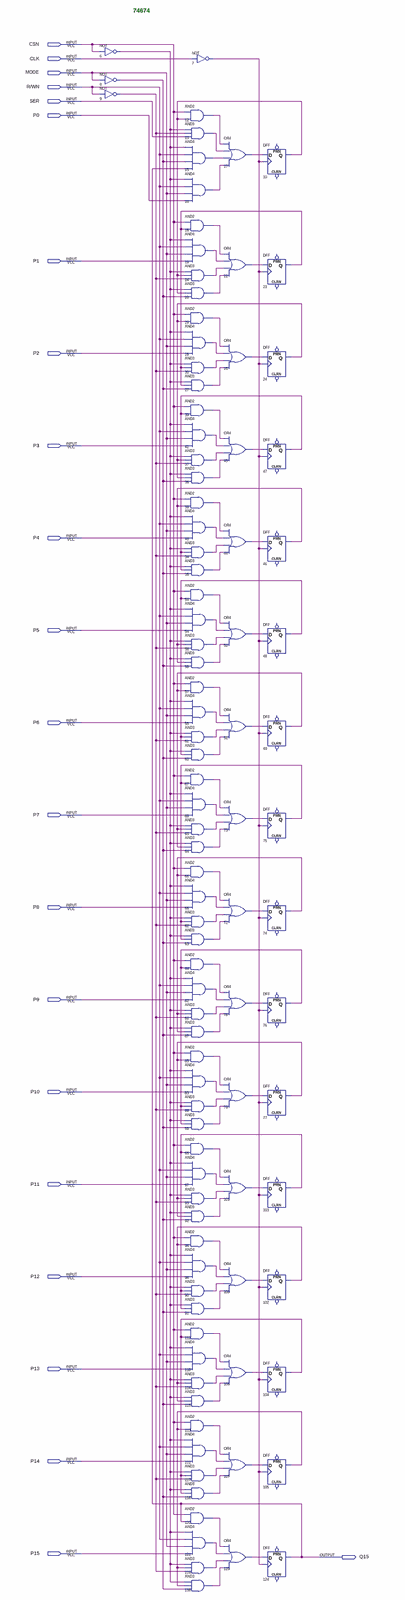
[diagram p0: schematic sheet, whole]
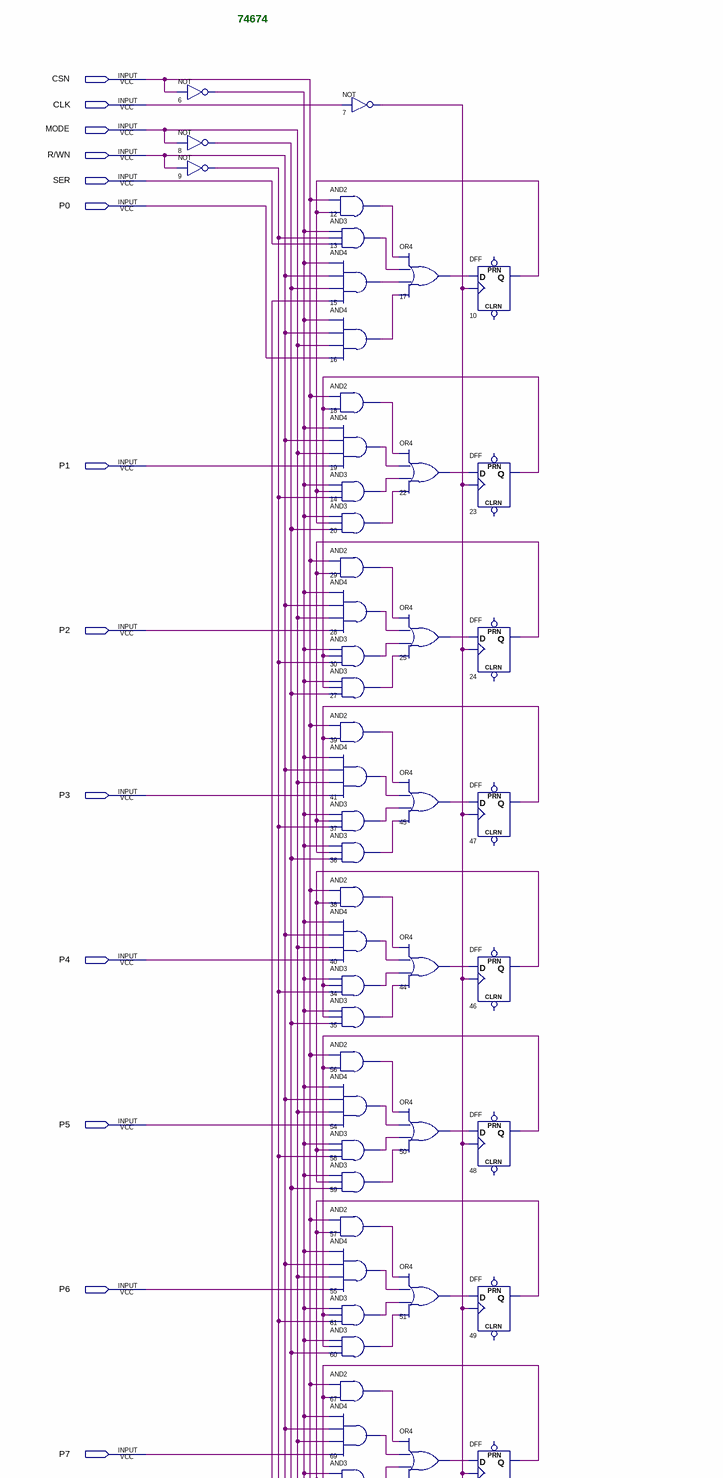
[diagram p1: schematic sheet, upper part]
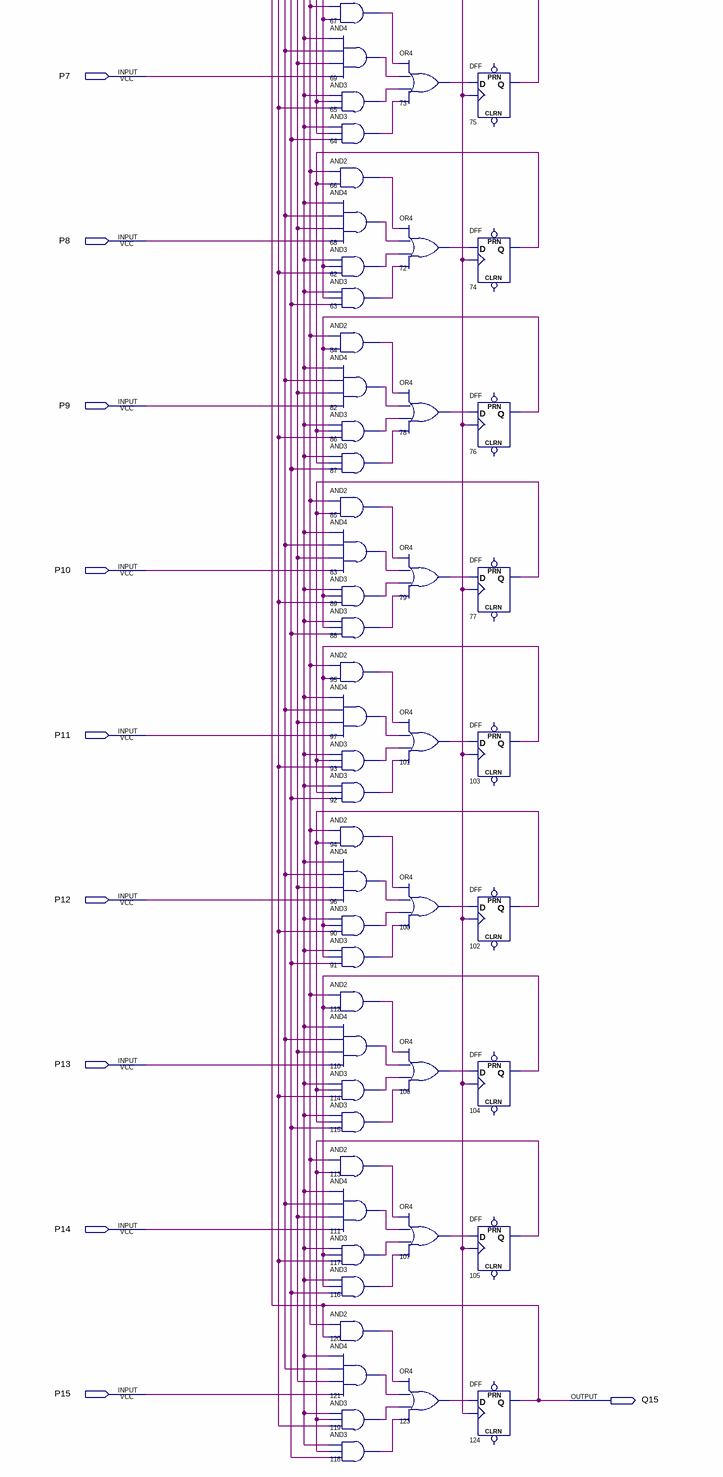
[diagram p2: schematic sheet, lower part]
// Quartus schematic 74674.bdf as structural Verilog: 100 symbols, 22 pins
module \74674  (
  input  CSN,
  input  CLK,
  input  MODE,
  input  \R/WN ,
  input  SER,
  input  P0,
  input  P1,
  input  P2,
  input  P3,
  input  P4,
  input  P5,
  input  P6,
  input  P7,
  input  P8,
  input  P9,
  input  P10,
  input  P11,
  input  P12,
  input  P13,
  input  P14,
  input  P15,
  output Q15
);

  wire n6_out, n7_out, n8_out, n9_out, n10_q, n12_out, n13_out, n14_out, n15_out, n16_out, n17_out, n18_out,
       n19_out, n20_out, n22_out, n23_q, n24_q, n25_out, n27_out, n28_out, n29_out, n30_out, n34_out,
       n35_out, n36_out, n37_out, n38_out, n39_out, n40_out, n41_out, n44_out, n45_out, n46_q, n47_q, n48_q,
       n49_q, n50_out, n51_out, n54_out, n55_out, n56_out, n57_out, n58_out, n59_out, n60_out, n61_out,
       n62_out, n63_out, n64_out, n65_out, n66_out, n67_out, n68_out, n69_out, n72_out, n73_out, n74_q,
       n75_q, n76_q, n77_q, n78_out, n79_out, n82_out, n83_out, n84_out, n85_out, n86_out, n87_out, n88_out,
       n89_out, n90_out, n91_out, n92_out, n93_out, n94_out, n95_out, n96_out, n97_out, n100_out, n101_out,
       n102_q, n103_q, n104_q, n105_q, n106_out, n107_out, n110_out, n111_out, n112_out, n113_out, n114_out,
       n115_out, n116_out, n117_out, n118_out, n119_out, n120_out, n121_out, n123_out;

  not u_6 (n6_out, CSN);
  not u_8 (n8_out, MODE);
  not u_9 (n9_out, \R/WN );
  not u_7 (n7_out, CLK);
  and u_12 (n12_out, CSN, n10_q);
  and u_13 (n13_out, n6_out, n9_out, SER);
  and u_15 (n15_out, n6_out, \R/WN , n8_out, Q15);
  and u_16 (n16_out, n6_out, \R/WN , MODE, P0);
  and u_18 (n18_out, CSN, n23_q);
  and u_19 (n19_out, n6_out, \R/WN , MODE, P1);
  and u_14 (n14_out, n6_out, n10_q, n9_out);
  and u_20 (n20_out, n6_out, n10_q, n8_out);
  and u_29 (n29_out, CSN, n24_q);
  and u_28 (n28_out, n6_out, \R/WN , MODE, P2);
  and u_30 (n30_out, n6_out, n23_q, n9_out);
  and u_27 (n27_out, n6_out, n23_q, n8_out);
  and u_39 (n39_out, CSN, n47_q);
  and u_41 (n41_out, n6_out, \R/WN , MODE, P3);
  and u_37 (n37_out, n6_out, n24_q, n9_out);
  and u_36 (n36_out, n6_out, n24_q, n8_out);
  and u_38 (n38_out, CSN, n46_q);
  and u_40 (n40_out, n6_out, \R/WN , MODE, P4);
  and u_34 (n34_out, n6_out, n47_q, n9_out);
  and u_35 (n35_out, n6_out, n47_q, n8_out);
  and u_56 (n56_out, CSN, n48_q);
  and u_54 (n54_out, n6_out, \R/WN , MODE, P5);
  and u_58 (n58_out, n6_out, n46_q, n9_out);
  and u_59 (n59_out, n6_out, n46_q, n8_out);
  and u_57 (n57_out, CSN, n49_q);
  and u_55 (n55_out, n6_out, \R/WN , MODE, P6);
  and u_61 (n61_out, n6_out, n48_q, n9_out);
  and u_60 (n60_out, n6_out, n48_q, n8_out);
  and u_67 (n67_out, CSN, n75_q);
  and u_69 (n69_out, n6_out, \R/WN , MODE, P7);
  and u_65 (n65_out, n6_out, n49_q, n9_out);
  and u_64 (n64_out, n6_out, n49_q, n8_out);
  and u_66 (n66_out, CSN, n74_q);
  and u_68 (n68_out, n6_out, \R/WN , MODE, P8);
  and u_62 (n62_out, n6_out, n75_q, n9_out);
  and u_63 (n63_out, n6_out, n75_q, n8_out);
  and u_84 (n84_out, CSN, n76_q);
  and u_82 (n82_out, n6_out, \R/WN , MODE, P9);
  and u_86 (n86_out, n6_out, n74_q, n9_out);
  and u_87 (n87_out, n6_out, n74_q, n8_out);
  and u_85 (n85_out, CSN, n77_q);
  and u_83 (n83_out, n6_out, \R/WN , MODE, P10);
  and u_89 (n89_out, n6_out, n76_q, n9_out);
  and u_88 (n88_out, n6_out, n76_q, n8_out);
  and u_95 (n95_out, CSN, n103_q);
  and u_97 (n97_out, n6_out, \R/WN , MODE, P11);
  and u_93 (n93_out, n6_out, n77_q, n9_out);
  and u_92 (n92_out, n6_out, n77_q, n8_out);
  and u_94 (n94_out, CSN, n102_q);
  and u_96 (n96_out, n6_out, \R/WN , MODE, P12);
  and u_90 (n90_out, n6_out, n103_q, n9_out);
  and u_91 (n91_out, n6_out, n103_q, n8_out);
  and u_112 (n112_out, CSN, n104_q);
  and u_110 (n110_out, n6_out, \R/WN , MODE, P13);
  and u_114 (n114_out, n6_out, n102_q, n9_out);
  and u_115 (n115_out, n6_out, n102_q, n8_out);
  and u_113 (n113_out, CSN, n105_q);
  and u_111 (n111_out, n6_out, \R/WN , MODE, P14);
  and u_117 (n117_out, n6_out, n104_q, n9_out);
  and u_116 (n116_out, n6_out, n104_q, n8_out);
  and u_120 (n120_out, CSN, Q15);
  and u_121 (n121_out, n6_out, \R/WN , MODE, P15);
  and u_119 (n119_out, n6_out, n105_q, n9_out);
  and u_118 (n118_out, n6_out, n105_q, n8_out);
  or u_17 (n17_out, n12_out, n13_out, n15_out, n16_out);
  or u_22 (n22_out, n18_out, n19_out, n14_out, n20_out);
  or u_25 (n25_out, n29_out, n28_out, n30_out, n27_out);
  or u_45 (n45_out, n39_out, n41_out, n37_out, n36_out);
  or u_44 (n44_out, n38_out, n40_out, n34_out, n35_out);
  or u_50 (n50_out, n56_out, n54_out, n58_out, n59_out);
  or u_51 (n51_out, n57_out, n55_out, n61_out, n60_out);
  or u_73 (n73_out, n67_out, n69_out, n65_out, n64_out);
  or u_72 (n72_out, n66_out, n68_out, n62_out, n63_out);
  or u_78 (n78_out, n84_out, n82_out, n86_out, n87_out);
  or u_79 (n79_out, n85_out, n83_out, n89_out, n88_out);
  or u_101 (n101_out, n95_out, n97_out, n93_out, n92_out);
  or u_100 (n100_out, n94_out, n96_out, n90_out, n91_out);
  or u_106 (n106_out, n112_out, n110_out, n114_out, n115_out);
  or u_107 (n107_out, n113_out, n111_out, n117_out, n116_out);
  or u_123 (n123_out, n120_out, n121_out, n119_out, n118_out);
  DFF u_10 (.CLK(n7_out), .D(n17_out), .Q(n10_q));  // open: CLRN, PRN
  DFF u_23 (.CLK(n7_out), .D(n22_out), .Q(n23_q));  // open: CLRN, PRN
  DFF u_24 (.CLK(n7_out), .D(n25_out), .Q(n24_q));  // open: CLRN, PRN
  DFF u_47 (.CLK(n7_out), .D(n45_out), .Q(n47_q));  // open: CLRN, PRN
  DFF u_46 (.CLK(n7_out), .D(n44_out), .Q(n46_q));  // open: CLRN, PRN
  DFF u_48 (.CLK(n7_out), .D(n50_out), .Q(n48_q));  // open: CLRN, PRN
  DFF u_49 (.CLK(n7_out), .D(n51_out), .Q(n49_q));  // open: CLRN, PRN
  DFF u_75 (.CLK(n7_out), .D(n73_out), .Q(n75_q));  // open: CLRN, PRN
  DFF u_74 (.CLK(n7_out), .D(n72_out), .Q(n74_q));  // open: CLRN, PRN
  DFF u_76 (.CLK(n7_out), .D(n78_out), .Q(n76_q));  // open: CLRN, PRN
  DFF u_77 (.CLK(n7_out), .D(n79_out), .Q(n77_q));  // open: CLRN, PRN
  DFF u_103 (.CLK(n7_out), .D(n101_out), .Q(n103_q));  // open: CLRN, PRN
  DFF u_102 (.CLK(n7_out), .D(n100_out), .Q(n102_q));  // open: CLRN, PRN
  DFF u_104 (.CLK(n7_out), .D(n106_out), .Q(n104_q));  // open: CLRN, PRN
  DFF u_105 (.CLK(n7_out), .D(n107_out), .Q(n105_q));  // open: CLRN, PRN
  DFF u_124 (.CLK(n7_out), .D(n123_out), .Q(Q15));  // open: CLRN, PRN

  // Notes on the sheet:
  //   74674
endmodule
